# Altium project Gimbal_Rev2.PrjPcb (part 2 of 2)

## Sheet POWER.SchDoc: Gimbal - Power
size Letter; Author: Aidan Gratton; DrawnBy: Aidan Gratton; Organization: UW Robotics; Address1: 200 University Avenue; Address2: Waterloo; Address3: Ontario; Address4: Canada N2L 3G6; SheetNumber: 2; SheetTotal: 7
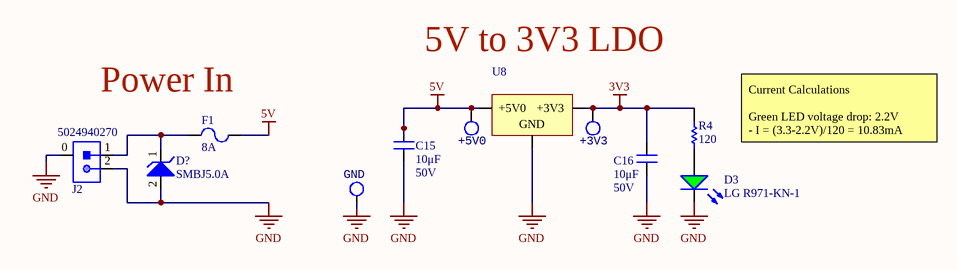
[diagram p4: POWER.SchDoc]

### Parts
+3V3  TESTPOINT_LOOP  [TESTPOINT_LOOP]  (value not drawn)
+5V0  TESTPOINT_LOOP  [TESTPOINT_LOOP]  (value not drawn)
C15  value 10μF  Voltage Rating: 50V  [CAPC1206(3216)]  (hidden comment: 10uF)
C16  value 10μF  Voltage Rating: 50V  [CAPC1206(3216)]  (hidden comment: 10uF)
D3  LG R971-KN-1  [LED_0805_LINE]
D?  Manufacturer Part Number 1: SMBJ5.0A  [TVS_DIODE_BIDIRECTIONAL]  (hidden comment: TVS_DIODE_UNIDIR_5V)
F1  Current Rating: 8A  [FUSE_1206]  (hidden comment: FUSE_8A_1206)
GND  TESTPOINT_LOOP  [TESTPOINT_LOOP]  (value not drawn)
J2  Manufacturer Part Number 1: 5024940270  [MOLEX-5024940270]  (hidden comment: CON_2M_SM_RA)
R4  value 120  [RESC0603(1608)_N]  (hidden comment: RES_120R_0603)
U8  5V0_3V3_LDO  [D2PAK_M]  (value not drawn)

### Nets
3V3: +3V3.1 C16.2 R4.2 U8.2(+3V3)
5V: +5V0.1 C15.2 F1.2 U8.3(+5V0)
GND: C15.1 C16.1 D3.2(K) D?.2 GND.1 J2.0 J2.2 U8.1(GND)
NetD3_1: D3.1(A) R4.1
NetD?_1: D?.1 F1.1 J2.1

### Notes on the sheet
- 5V to 3V3 LDO
- Power In
- Current Calculations
  Green LED voltage drop: 2.2V
  - I = (3.3-2.2V)/120 = 10.83mA
- Title
- Size:
- Date:
- Letter
- Drawn By:
- Sheet
- of
- File:

### Library data of the parts
+3V3 +5V0 GND = TESTPOINT_LOOP: Loop testpoint through-hole pad; Manufacturer Part Number 1: 5002; Manufacturer 1: Keystone Electronics; Supplier Part Number 1: 36-5002-ND; Supplier 1: Digi-Key; Mount: Through Hole
C15 C16 = CAP_10uF_50V_1206: CAP CER 10UF 50V X5R 1206; Manufacturer Part Numer 1: GRT31CR61H106KE01L; Manufacturer 1: Murata; Dimensions: 0.126" L x 0.063" W (3.20mm x 1.6mm); Package: 1206 (3216 Metric); Supplier Part Number 1: 490-12456-1-ND; Supplier 1: Digi-Key; Mount: Surface Mount; Case Code (Imperial): 1206; Case Code (Metric): 3216; Manufacturer Part Number 1: GRT31CR61H106KE01L; Dielectric: X5R
D3 = DIO_LED_G: LED GREEN DIFFUSED 0805 SMD; Manufacturer 1: OSRAM; Forward Voltage Drop: 2.2V; Package: 0805 (2012 Metric); Supplier Part Number 1: 475-1410-1-ND; Supplier 1: Digi-Key; Manufacturer Part Number 1: LG R971-KN-1; Mount: Surface Mount
D? = TVS_DIODE_UNIDIR_5V: TVS DIODE 5V 9.2V DO214AA; Manufacturer 1: Littelfuse; Max Power Dissipation: 600W; Polarity: Unidirectional; Number of Elements: 1; Leakage Current: 800uA; Reverse Breakdown Voltage: 6.4V; Max Surge Current: 65.3A; Max Breakdown Voltage: 7V; Test Current: 10mA; Element Configuration: Single; Power Line Protection: No; Current: 68A; ESD Protection: Yes; Supplier 1: Digi-Key; Stock 1: 14825; Pricing 1: 1=0.41000, 10=0.30500, 25=0.27520, 100=0.14500, 250=0.14352, 500=0.12850, 1000=0.10000 (USD); RoHS: Yes; Mount: Surface Mount; Case/Package: SMB; Number of Pins: 2; Min Operating Temperature: -55°C; Max Operating Temperature: 150°C; Packaging: Tape and Reel; Package Quantity: 3000; Power Dissipation: 600W; Direction: Unidirectional; Reverse Standoff Voltage: 5V; Min Breakdown Voltage: 6.4V; Clamping Voltage: 9.2V; Peak Pulse Power: 600W; Breakdown Voltage: 6.4V; Termination: SMD/SMT; Peak Pulse Current: 65.3A; Number of Channels: 1; Max Reverse Leakage Current: 800uA; Operating Supply Voltage: 5V; Number of Unidirectional Channels: 1; Composition: Zener; Voltage Rating (DC): 5V; Voltage: 5V; Length: 0.179inch; Height: 0.096inch; Width: 0.155inch; Radiation Hardening: No; REACH SVHC: Unknown; Lead Free: Lead Free; ComponentLink1URL: https://www.littelfuse.com/~/media/electronics/datasheets/tvs_diodes/littelfuse_tvs_diode_smbj_datasheet.pdf.pdf; ComponentLink1Description: Datasheet; ComponentLink2URL: https://datasheet.ciiva.com/25624/0900766b810f4eeb-25624712.pdf?src-supplier=RSComponents; ComponentLink2Description: https://datasheet.ciiva.com/25624/0900766b810f4eeb-25624712.pdf?src-supplier=RSComponents; ComponentLink3URL: https://datasheet.ciiva.com/34302/1546929-34302459.pdf?src-supplier=Jameco; ComponentLink3Description: https://datasheet.ciiva.com/34302/1546929-34302459.pdf?src-supplier=Jameco; ComponentLink4URL: https://datasheet.ciiva.com/46381/1677318-46381958.pdf?src-supplier=Element14; ComponentLink4Description: https://datasheet.ciiva.com/46381/1677318-46381958.pdf?src-supplier=Element14; ComponentLink5URL: https://datasheet.ciiva.com/331/littelfuse-tvs-diode-smbj-datasheet-pdf-331131.pdf?src-supplier=Digi-Key; ComponentLink5Description: https://datasheet.ciiva.com/331/littelfuse-tvs-diode-smbj-datasheet-pdf-331131.pdf?src-supplier=Digi-Key; ComponentLink6URL: https://datasheet.ciiva.com/331/littelfuse-tvs-diode-smbj-datasheet-pdf-331132.pdf?src-supplier=Digi-Key; ComponentLink6Description: https://datasheet.ciiva.com/331/littelfuse-tvs-diode-smbj-datasheet-pdf-331132.pdf?src-supplier=Digi-Key; Supplier Part Number 1: SMBJ5.0ALFCT-ND; ComponentLink7URL: https://datasheet.ciiva.com/331/littelfuse-tvs-diode-smbj-datasheet-pdf-331133.pdf?src-supplier=Digi-Key; ComponentLink7Description: https://datasheet.ciiva.com/331/littelfuse-tvs-diode-smbj-datasheet-pdf-331133.pdf?src-supplier=Digi-Key
F1 = FUSE_8A_1206: FUSE SMD 8A 24V; Manufacturer 1: Littelfuse; Manufacturer Part Number 1: 0469008.WR; Fuse Type: Board Mount (Cartridge Style Excluded); DC Cold Resistance: 31mR; Power Dissipation: 157.5mW; Approvals: UL,CSA; Supplier 1: Digi-Key; Stock 1: 8989; Pricing 1: 1=0.84000, 5=0.81200, 10=0.78700, 50=0.66180, 100=0.54930, 250=0.49940, 500=0.42450, 1000=0.37455 (USD); RoHS: Yes; Mount: Surface Mount; Case/Package: 1206; Case Code (Imperial): 1206; Case Code (Metric): 3216; Housing Material: Ceramic; Min Operating Temperature: -55°C; Max Operating Temperature: 90°C; Package Quantity: 5000; Voltage Rating (AC): 24V; Voltage Rating (DC): 24V; Packaging: Cut Tape; Current: 8A; Length: 3.18mm; Height: 0.023inch; Width: 0.06inch; Depth: 1.52mm; ComponentLink1URL: https://datasheet.ciiva.com/7444/littelfuse-fuse-466-7444359.pdf?src-supplier=Digi-Key; ComponentLink1Description: https://datasheet.ciiva.com/7444/littelfuse-fuse-466-7444359.pdf?src-supplier=Digi-Key; ComponentLink2URL: https://datasheet.ciiva.com/7444/littelfuse-fuse-466-7444363.pdf?src-supplier=Digi-Key; ComponentLink2Description: https://datasheet.ciiva.com/7444/littelfuse-fuse-466-7444363.pdf?src-supplier=Digi-Key; ComponentLink3URL: https://datasheet.ciiva.com/7444/littelfuse-fuse-466-7444350.pdf?src-supplier=Digi-Key; ComponentLink3Description: https://datasheet.ciiva.com/7444/littelfuse-fuse-466-7444350.pdf?src-supplier=Digi-Key; Supplier Part Number 1: F3542CT-ND
J2 = CON_2M_SM_RA: CONN HEADER SMD RIGHT ANGLE 2MM PITCH; Manufacturer 1: Molex; Connector Type: Receptacle,Forked; Number of Positions: 2; Supplier 1: Digi-Key; Stock 1: 3397; Pricing 1: 1=0.53000, 10=0.49400, 25=0.44440, 50=0.39500, 100=0.37850, 250=0.34556 (USD); RoHS: No; Mount: Surface Mount; Contact Plating: Tin; Insulation Color: Natural; Insulation Material: Resin; Min Operating Temperature: -40°C; Max Operating Temperature: 105°C; Fastening Type: Latch; Packaging: Tape and Reel; Number of Rows: 1; Termination: Solder; Flammability Rating: UL94 V-0; ComponentLink1URL: https://www.molex.com/pdm_docs/as/AS-502439-002-001.pdf?src-supplier=Digi-Key; ComponentLink1Description: https://www.molex.com/pdm_docs/as/AS-502439-002-001.pdf?src-supplier=Digi-Key; Supplier Part Number 1: WM15810CT-ND
R4 = RES_120R_0603: RES SMD 120 OHM 5% 1/10W 0603; Manufacturer 1: Yageo; Manufacturer Part Number 1: RC0603JR-07120RL; Package: 0603 (1608 Metric); Dimensions: 0.063" L x 0.031" W (1.60mm x 0.80mm); Tolerance: 5%; Supplier Part Number 1: 311-120GRCT-ND; Supplier 1: Digi-Key; Mount: Surface Mount
U8 = 5V0_3V3_LDO: IC REG LINEAR 3.3V 1A DPAK; Manufacturer Part Number 1: NCP1117DT33T5G; Manufacturer 1: ON Semiconductor; Current Output: 1A; Supplier Part Number 1: NCP1117DT33T5GOSCT-ND; Supplier 1: Digi-Key; Mount: Surface Mount

## Nets that join several sheets
3V3: MCU (18 pins), Sensors (6 pins), Connectors (J1.1 R7.2), CAN (C1.2 C2.2 U1.3 U2.3), POWER (+3V3.1 C16.2 R4.2 U8.2)
5V: Sensors (6 pins), Connectors (7 pins), POWER (+5V0.1 C15.2 F1.2 U8.3)
GND: MCU (25 pins), Sensors (12 pins), Connectors (23 pins), CAN (10 pins), POWER (8 pins)
CAN1_A_N: Connectors (D8.1 D10.1 J6.2 J7.2), CAN (C29.2 CAN1_N.1 CMC2.5)
CAN1_A_P: Connectors (D8.2 D10.2 J6.1 J7.1), CAN (C28.2 CAN1_P.1 CMC2.4)
CAN2_A_N: Connectors (D9.1 D11.1 J6.5 J7.5), CAN (C27.2 CAN2_N.1 CMC1.5)
CAN2_A_P: Connectors (D9.2 D11.2 J6.4 J7.4), CAN (C26.2 CAN2_P.1 CMC1.4)
NetCR_SERVO_1: MCU (U7.35), Connectors (CR_SERVO.1 J3.5)
NetECHO1_1: MCU (U7.59), Sensors (ECHO1.1 R13.1 R14.2)
NetECHO2_1: MCU (U7.62), Sensors (ECHO2.1 R15.1 R16.1)
NetENC1_1: MCU (U7.17), Sensors (ENC1.1 R21.1 R22.1)
NetJ1_2: MCU (TX1.1 U7.51), Connectors (J1.2)
NetJ1_3: MCU (RX1.1 U7.52), Connectors (J1.3)
NetJ1_6: MCU (U7.46), Connectors (J1.6)
NetJ1_7: MCU (U7.49), Connectors (J1.7)
NetJ1_8: MCU (R17.1 RST.2), Connectors (J1.8)
NetJ3_1: MCU (U7.36), Connectors (J3.1 STD_SERVO.1)
NetJ4_3: Sensors (R13.2), Connectors (J4.3)
NetJ4_5: Sensors (6 pins), Connectors (J4.5 J4.11 R5.1)
NetJ4_9: Sensors (R15.2), Connectors (J4.9)
NetJ4_10: MCU (U7.2), Connectors (J4.10 R7.1)
NetJ4_15: Sensors (U4.13), Connectors (J4.15)
NetJ4_17: Sensors (U4.12), Connectors (J4.17)
NetJ4_19: Sensors (U4.11), Connectors (J4.19)
NetJ4_23: Sensors (R22.2), Connectors (J4.23)
NetJ5_1: Sensors (LED_BOARD_R.1 U5.13), Connectors (J5.1)
NetJ5_2: Sensors (LED_BOARD_G.1 U5.12), Connectors (J5.2)
NetJ5_3: Sensors (LED_BOARD_B.1 U5.11), Connectors (J5.3)
NetSPI_MISO_1: MCU (U7.22), Sensors (SPI_MISO.1 U4.4)
NetSPI_MOSI_1: MCU (U7.23), Sensors (SPI_MOSI.1 U4.2)
NetSPI_SCK_1: MCU (U7.21), Sensors (SPI_SCK.1 U4.3)
NetU1_1: MCU (U7.45), CAN (U1.1)
NetU1_4: MCU (U7.44), CAN (U1.4)
NetU2_1: MCU (U7.34), CAN (U2.1)
NetU2_4: MCU (U7.33), CAN (U2.4)
NetU3_2: MCU (U7.58), Sensors (U3.2)
NetU3_3: MCU (U7.61), Sensors (U3.3)
NetU3_4: MCU (U7.16), Sensors (U3.4)
NetU5_2: MCU (U7.24), Sensors (U5.2)
NetU5_3: MCU (U7.25), Sensors (U5.3)
NetU5_4: MCU (U7.37), Sensors (U5.4)